# EAGLE design Wapuugotchi (EAGLE 8.3.1)
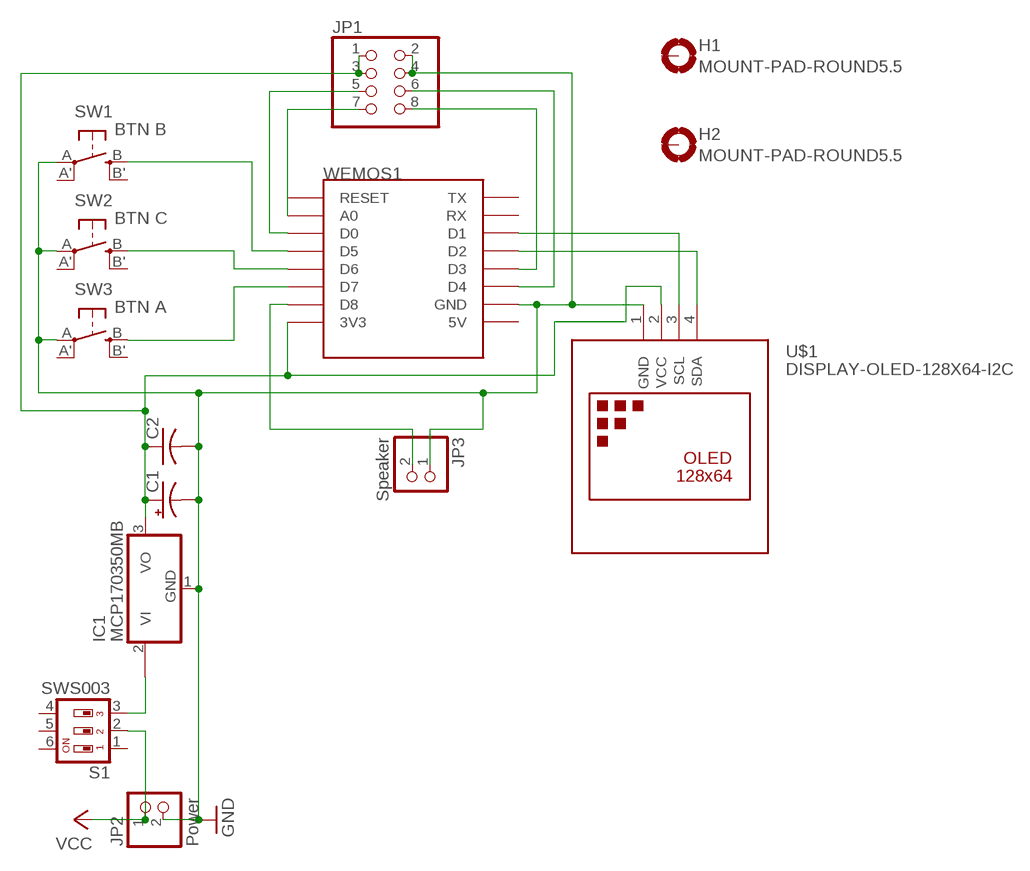
[diagram p0: schematic, sheet 1]

## Parts
C1  CPOL-US153CLV-1012  [153CLV-1012]
C2  C-USC0805  [C0805]
H1  MOUNT-PAD-ROUND5.5  [5,5-PAD]
H2  MOUNT-PAD-ROUND5.5  [5,5-PAD]
IC1  MCP170350MB  [SOT89]
JP1  PINHD-2X4  [2X04]
JP2  Power  PINHD-1X2  [1X02]
JP3  Speaker  PINHD-1X2  [1X02]
S1  SWS003  [SMS-003]
SW1  BTN B  SPST_TACT-EVQQ2  [EVQ-Q2]
SW2  BTN C  SPST_TACT-EVQQ2  [EVQ-Q2]
SW3  BTN A  SPST_TACT-EVQQ2  [EVQ-Q2]
U$1  DISPLAY-OLED-128X64-I2C  [DISPLAY-OLED-128X64-I2C]
WEMOS1  WEMOS-D1-MINI  [WEMOS-D1-MINI]

## Nets
GND: C1.- C2.2 IC1.1(GND) JP1.2 JP1.4 JP2.2 JP3.1 SW1.A(P) SW2.A(P) SW3.A(P) U$1.1(GND) WEMOS1.GND
N$1: U$1.3(SCL) WEMOS1.D1
N$2: U$1.4(SDA) WEMOS1.D2
N$3: SW3.B(S) WEMOS1.D7
N$4: SW2.B(S) WEMOS1.D6
N$5: SW1.B(S) WEMOS1.D5
N$6: JP3.2 WEMOS1.D8
N$7: JP1.7 WEMOS1.A0
N$8: JP1.5 WEMOS1.D0
N$9: JP1.8 WEMOS1.D3
N$10: JP1.6 WEMOS1.D4
N$11: C1.+ C2.1 IC1.3(VO) JP1.1 JP1.3 U$1.2(VCC) WEMOS1.3V3
N$12: IC1.2@1(VI1) S1.3
VCC: JP2.1 S1.2
Unconnected: H1.B5,5(MOUNT) H2.B5,5(MOUNT) IC1.2(VI) S1.1 S1.4 S1.5 S1.6 SW1.A'(P1) SW1.B'(S1) SW2.A'(P1) SW2.B'(S1) SW3.A'(P1) SW3.B'(S1) WEMOS1.5V WEMOS1.RESET WEMOS1.RX WEMOS1.TX

## Library data of the parts
C1 = adafruit:CPOL-US: POLARIZED CAPACITOR, American symbol
C2 = adafruit:C-US: CAPACITOR, American symbol
H1 H2 = holes:MOUNT-PAD-ROUND: MOUNTING PAD, round
IC1 = linear:MCP1703*: 250 mA, 16V, Low Quiescent Current LDO Regulator Source: http://ww1.microchip.com/downloads/en/DeviceDoc/22049b.pdf
JP1 = pinhead:PINHD-2X4: PIN HEADER
JP2 JP3 = pinhead:PINHD-1X2: PIN HEADER
S1 = smd-special:SWS003: SMD Dip Switch 3 pol.
SW1-SW3 = adafruit:SPST_TACT: SMT 6mm switch, EVQQ2 series http://www.ladyada.net/library/eagle
U$1 = diy-modules:DISPLAY-OLED-128X64-I2C: 128x64 Dot Matrix OLED Module based on SSD1306 chip Variant with I2C interface More details available here: http://www.instructables.com/id/Monochrome-096-i2c-OLED-display-with-arduino-SSD13/ SSD1306 datasheet: https://cdn-shop.adafruit.com/datasheets/SSD1306.pdf Click here to find device on ebay.com <http://www.ebay.com/sch/oled+display+128x64+iic> Note: There are two variants: I2C and SPI. Search for the proper version.
WEMOS1 = esp8266modules:WEMOS-D1-MINI: WeMos.cc D1 mini ESP8266 module

## Board
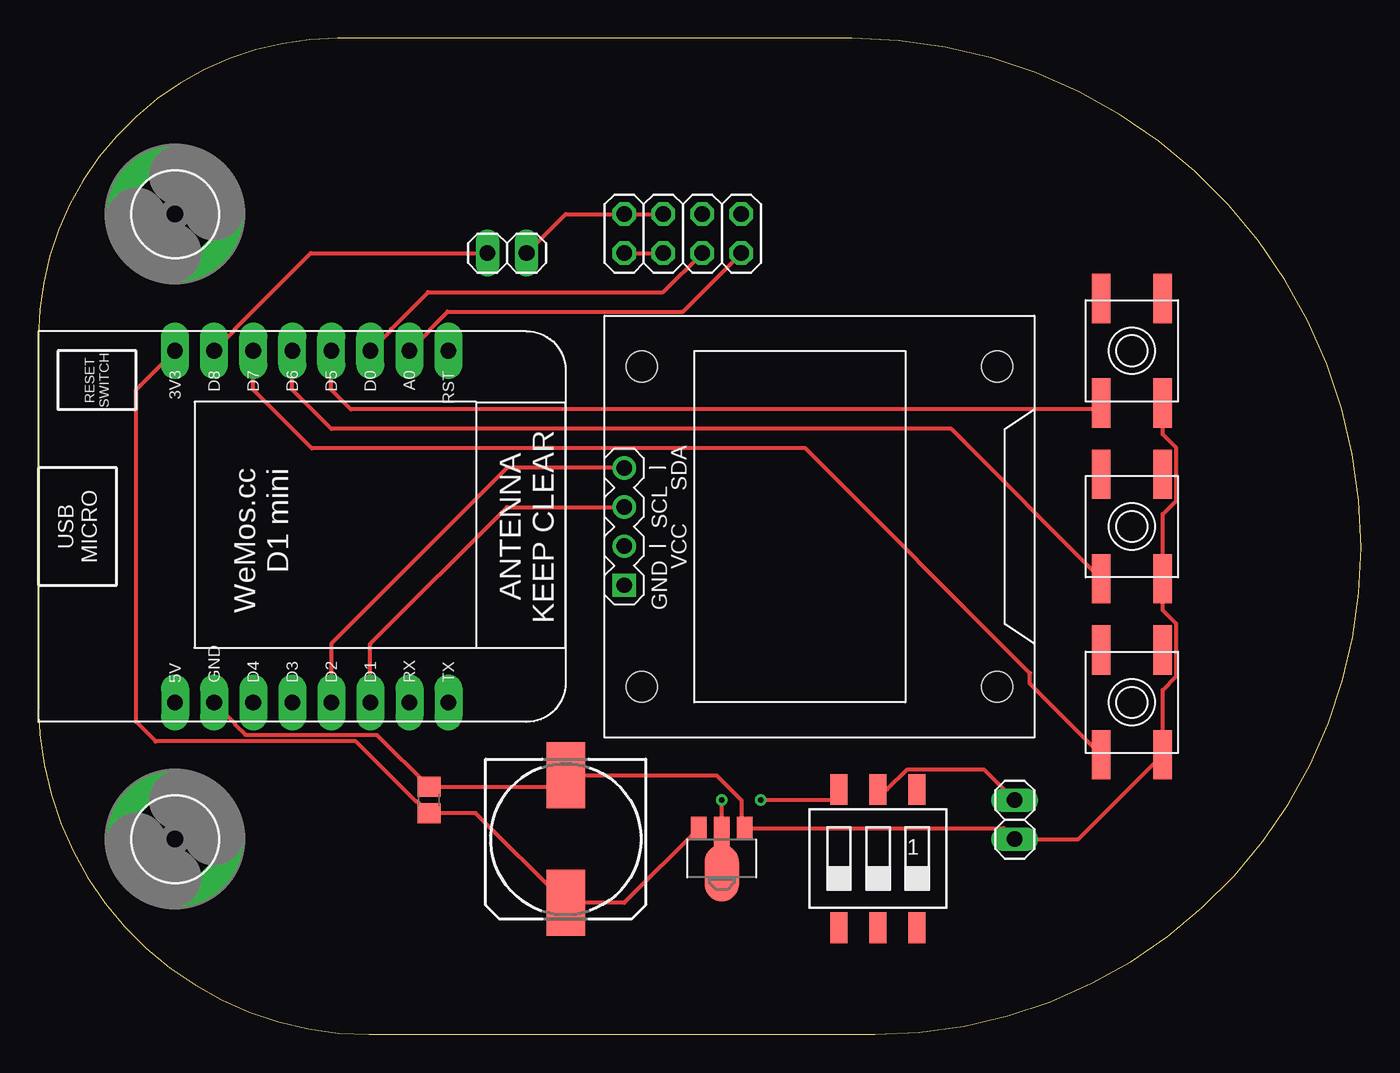
[diagram p1: board, top side]
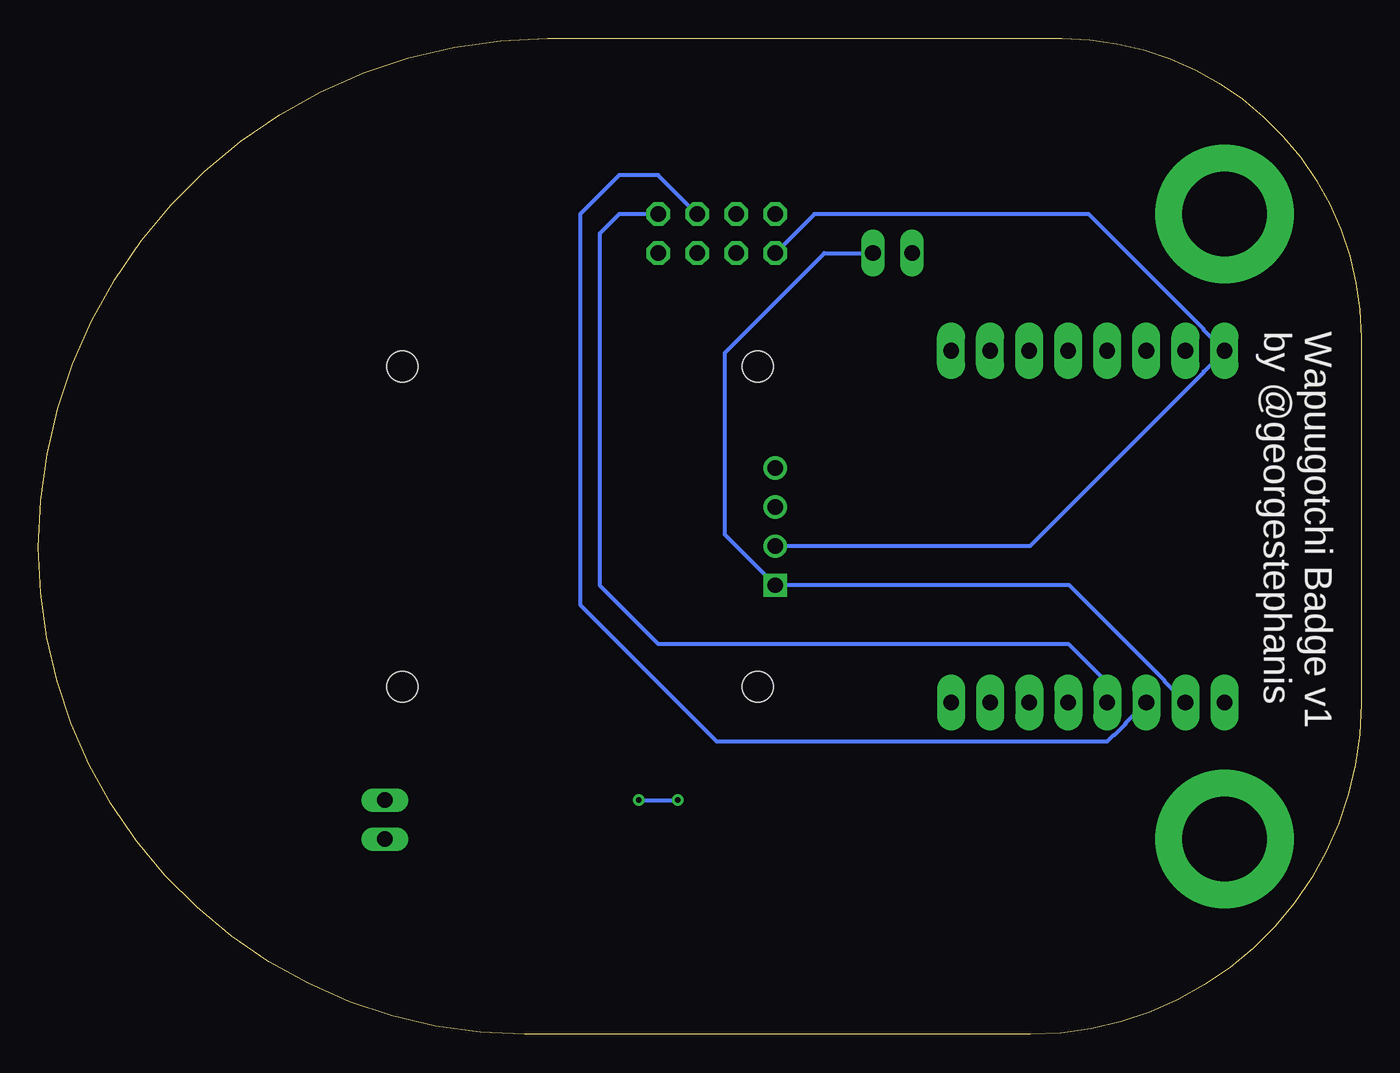
[diagram p2: board, bottom side, seen from below]

Size 86.03 x 64.76 mm. Coordinates in mm from the lower left corner, seen from the top.
Outline: 0,45.31 0,21.5 arc90 21.5,0 54.4,0 arc90 86.03,31.63 arc90 52.9,64.76 19.45,64.76 arc90 0,45.31
Copper layers (1*16): Top 0.035mm / dielectric 1.5mm / Bottom 0.035mm
Design rules "default": minimum track width 6mil, minimum drill 0.35mm, track to track 6mil, track to pad 6mil, pad to pad 6mil, via to via 6mil, smd to smd 6mil, copper to edge 40mil, drill to drill 6mil, minimum pad ring 10mil, minimum via ring 8mil, stop-mask expansion 4mil, vias tented up to drill 0mil, thermal gap 10mil

### Footprints (pad centres in the part's own frame; a part is rotated, then mirrored left to right if it is on the bottom)
153CLV-1012 = smd 4.3 x 2.5: + 4.15,0; - -4.15,0
C0805 = smd 1.3 x 1.5: 1 -0.85,0; 2 0.85,0
5,5-PAD = drill 5.5 pad 9: B5,5 0,0
SOT89 = smd 1 x 1.5: 1 -1.499,-1.981; 3 1.499,-1.981 | smd 1 x 2: 2 0,-1.727 | smd 2.2 x 3.7: 2@1 0,0.94
2X04 = drill 1.016 octagon: 1 -3.81,-1.27; 2 -3.81,1.27; 3 -1.27,-1.27; 4 -1.27,1.27; 5 1.27,-1.27; 6 1.27,1.27; 7 3.81,-1.27; 8 3.81,1.27
1X02 = drill 1.016 long: 1 -1.27,0; 2 1.27,0
SMS-003 = smd 1.092 x 2.007: 1 -2.54,-4.496; 2 0,-4.496; 3 2.54,-4.496; 4 2.54,4.496; 5 0,4.496; 6 -2.54,4.496
EVQ-Q2 = smd 3.2 x 1.2: A -3.4,-2; A' 3.4,-2; B -3.4,2; B' 3.4,2
DISPLAY-OLED-128X64-I2C = drill 1 square: 1 -3.81,12.7 | drill 1: 2 -1.27,12.7; 3 1.27,12.7; 4 3.81,12.7 | hole 2: -10.414,11.557; 10.414,11.557; 10.414,-11.557; -10.414,-11.557
WEMOS-D1-MINI = drill 1.016 pad 1.829 long: 3V3 -10.16,-10.16; 5V 12.7,-10.16; A0 -10.16,5.08; D0 -10.16,2.54; D1 12.7,2.54; D2 12.7,0; D3 12.7,-2.54; D4 12.7,-5.08; D5 -10.16,0; D6 -10.16,-2.54; D7 -10.16,-5.08; D8 -10.16,-7.62; GND 12.7,-7.62; RESET -10.16,7.62; RX 12.7,5.08; TX 12.7,7.62

### Placement (x,y rotation side)
C1  34.29,12.7 270 top
C2  25.4,15.24 90 top
H1  8.89,53.34 0 top
H2  8.89,12.7 0 top
IC1  44.45,11.43 180 top
JP1  41.91,52.07 0 top
JP2  63.5,13.97 270 top
JP3  30.48,50.8 180 top
S1  54.61,11.43 180 top
SW1  71.12,44.45 90 top
SW2  71.12,33.02 90 top
SW3  71.12,21.59 90 top
U$1  50.8,33.02 90 top
WEMOS1  19.05,34.29 270 top

### Tracks (layer width: path | path; a pad name or v marks a point on that pad's centre or on a via)
GND
  Top 0.254: WEMOS1.GND 12.78,20.24 12.78,20.18 13.48,19.48 22.01,19.48 C2.2 33.53,16.09 C1.- 44.11,16.85 45.72,15.24 45.72,13.64 IC1.1 62.79,13.41 JP2.2 67.63,12.7 SW3.A 73.12,22.39 74,23.27 74,26.71 73.12,27.58 SW2.A 73.12,33.83 74,34.7 74,38.14 73.12,39.02 SW1.A | 38.26,53.34 JP1.2 | 38.26,53.34 JP1.4 | JP3.1 34.29,53.34 38.26,53.34
  Bottom 0.254: WEMOS1.GND 12.78,22.94 12.78,23 18.99,29.21 U$1.1 41.39,32.5 41.39,44.32 34.91,50.8 JP3.1
N$1
  Top 0.254: WEMOS1.D1 21.59,25.4 30.48,34.29 U$1.3
N$2
  Top 0.254: U$1.4 30.48,36.83 19.05,25.4 WEMOS1.D2
N$3
  Top 0.254: SW3.B 64.5,22.81 64.5,23.49 49.89,38.1 17.78,38.1 13.97,41.91 WEMOS1.D7
N$4
  Top 0.254: SW2.B 59.37,39.37 19.05,39.37 16.51,41.91 WEMOS1.D6
N$5
  Top 0.254: SW1.B 68.71,40.64 20.32,40.64 19.05,41.91 WEMOS1.D5
N$6
  Top 0.254: WEMOS1.D8 12.78,45.8 12.78,45.86 17.72,50.8 JP3.2
N$7
  Top 0.254: WEMOS1.A0 25.48,45.8 25.48,45.86 26.61,46.99 41.91,46.99 JP1.7
N$8
  Top 0.254: WEMOS1.D0 22.94,45.8 22.94,45.86 25.34,48.26 40.64,48.26 JP1.5
N$9
  Bottom 0.254: JP1.8 48.26,53.34 49.53,52.07 49.53,29.21 45.72,25.4 19.05,25.4 16.51,22.86 WEMOS1.D3
N$10
  Bottom 0.254: JP1.6 45.72,55.88 48.26,55.88 50.8,53.34 50.8,27.94 41.91,19.05 16.51,19.05 16.08,19.48 16.02,19.48 15.32,20.18 15.32,20.24 WEMOS1.D4
N$11
  Top 0.254: IC1.3 38.09,8.55 C1.+ 28.45,14.39 C2.1 24.63,15.16 24.53,15.16 20.64,19.05 7.62,19.05 6.35,20.32 6.35,41.91 WEMOS1.3V3 | JP1.1 JP1.3
  Bottom 0.254: U$1.2 21.53,31.75 10.24,43.04 10.24,43.1 WEMOS1.3V3 10.24,45.8 10.24,45.86 17.72,53.34 35.56,53.34 JP1.1
N$12  (via drill 0.35)
  Top 0.254: S1.3 52.07,15.24 v46.99,15.24 | IC1.2@1 v44.45,15.24
  Bottom 0.254: v46.99,15.24 v44.45,15.24
VCC
  Top 0.254: S1.2 55.2,15.93 56.49,17.21 61.53,17.21 JP2.1

### Text on the board
bPlace: Wapuugotchi Badge v1 / by @georgestephanis